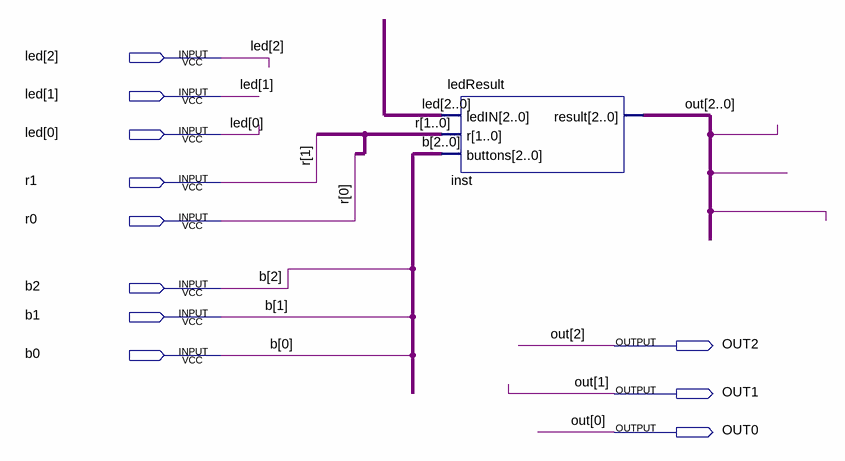
[diagram p0: schematic sheet]
// Quartus schematic testeIF.bdf as structural Verilog: 1 symbols, 11 pins
module testeIF (
  input  [2:0] led,
  input  r1,
  input  r0,
  input  b2,
  input  b1,
  input  b0,
  output OUT2,
  output OUT1,
  output OUT0
);

  ledResult inst (.ledIN(led), .r({r1, r0}), .buttons({b2, b1, b0}), .result({OUT2, OUT1, OUT0}));
endmodule
